# EAGLE design PiKVM_ATX_Adapter v1 (EAGLE 9.6.2)
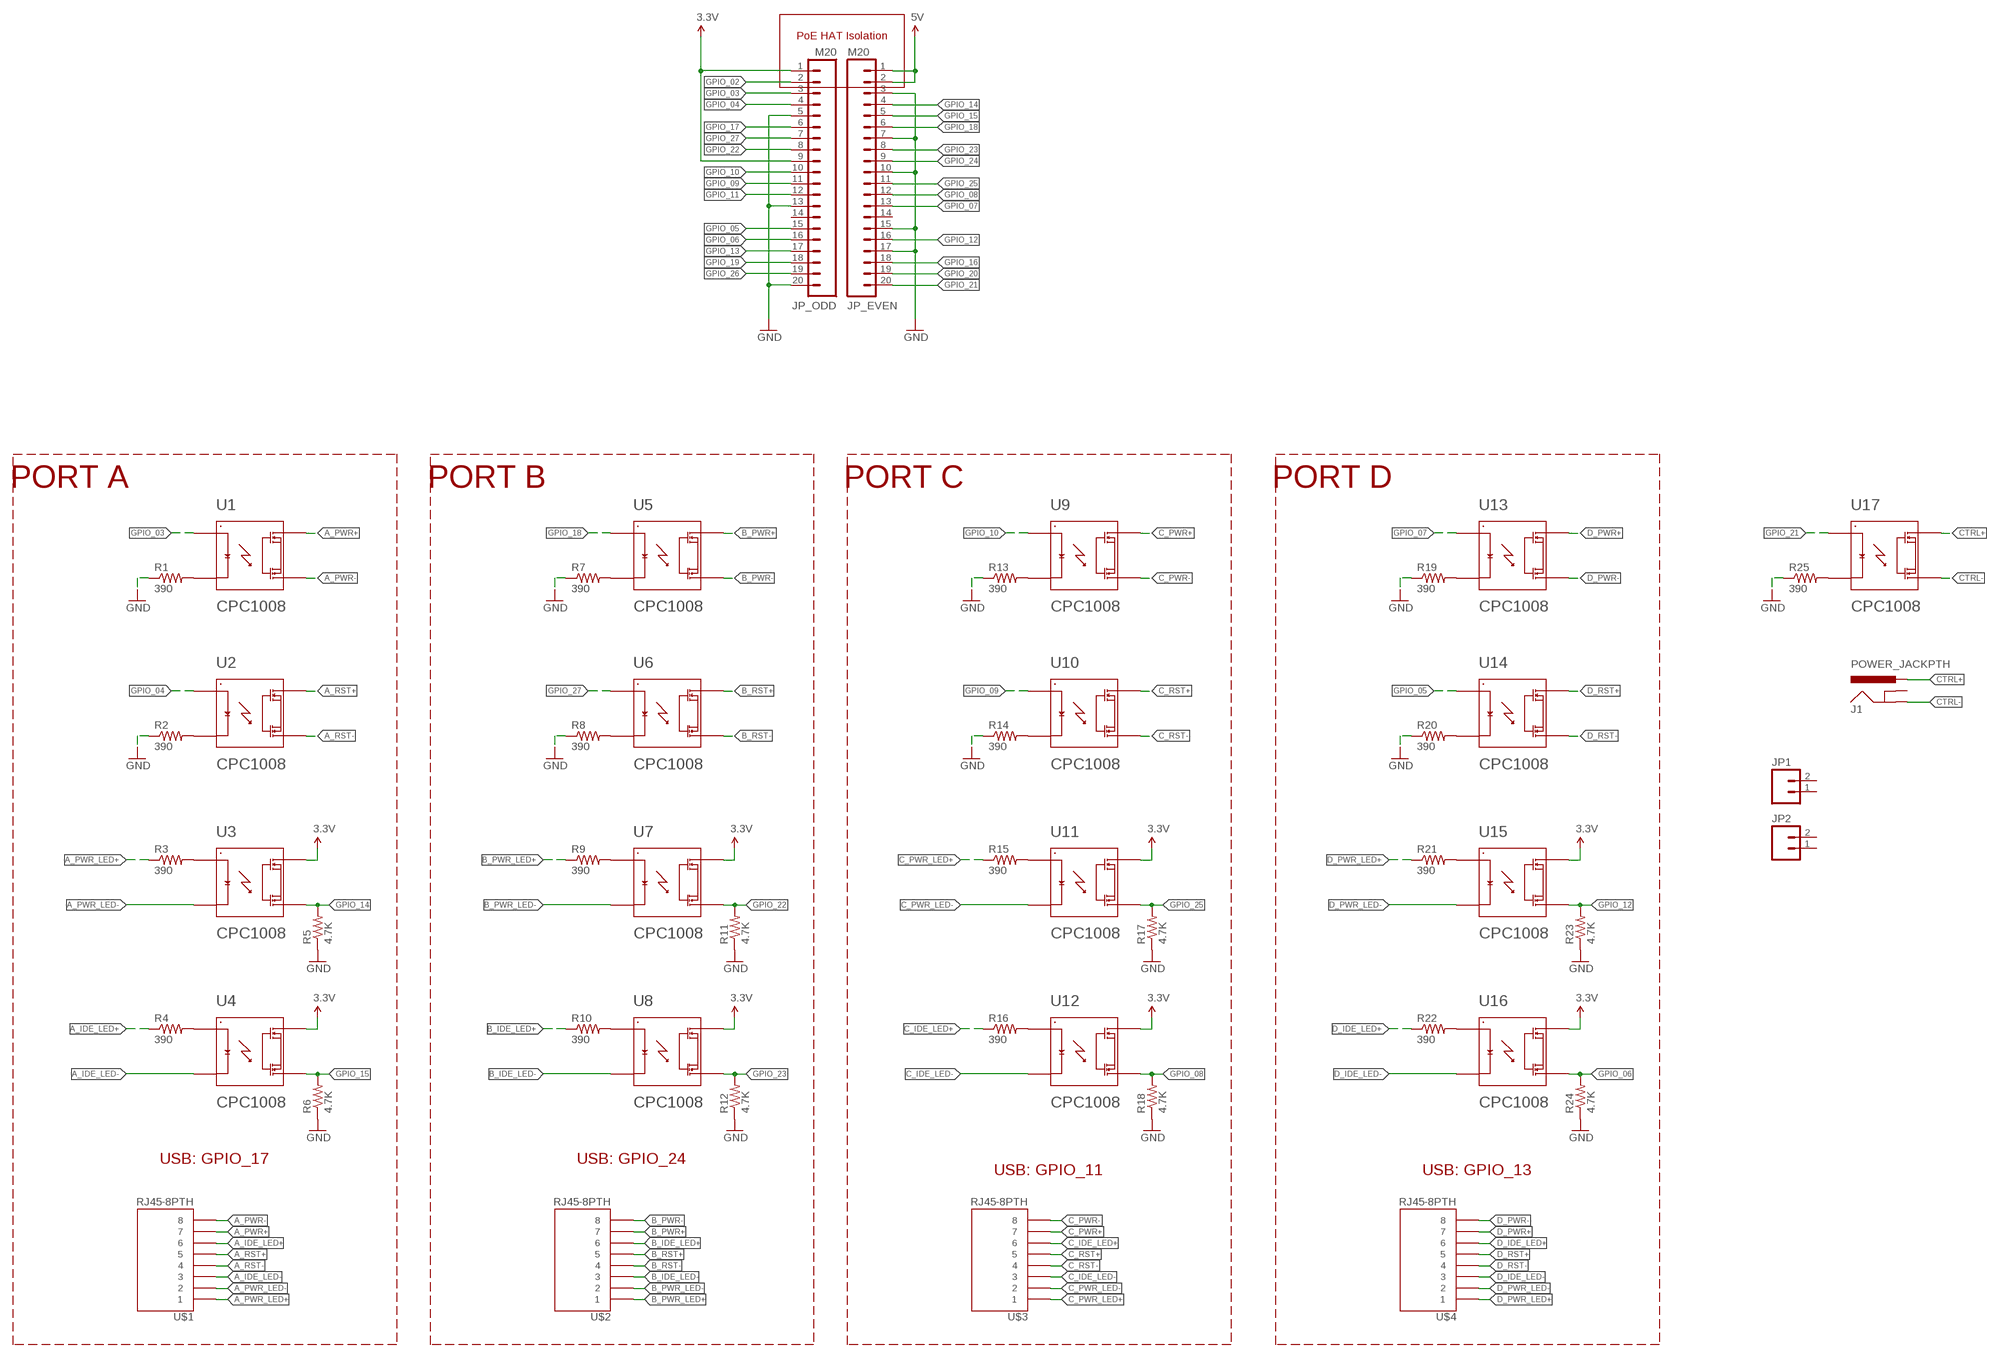
[diagram p0: schematic, sheet 1]

## Parts
J1  POWER_JACKPTH  [POWER_JACK_PTH]
JP1  M02LOCK  [1X02_LOCK]
JP2  M02LOCK  [1X02_LOCK]
JP_EVEN  M20  [1X20]
JP_ODD  M20  [1X20]
R1  390  RESISTOR1206  [1206]
R2  390  RESISTOR1206  [1206]
R3  390  RESISTOR1206  [1206]
R4  390  RESISTOR1206  [1206]
R5  4.7K  RESISTOR1206  [1206]
R6  4.7K  RESISTOR1206  [1206]
R7  390  RESISTOR1206  [1206]
R8  390  RESISTOR1206  [1206]
R9  390  RESISTOR1206  [1206]
R10  390  RESISTOR1206  [1206]
R11  4.7K  RESISTOR1206  [1206]
R12  4.7K  RESISTOR1206  [1206]
R13  390  RESISTOR1206  [1206]
R14  390  RESISTOR1206  [1206]
R15  390  RESISTOR1206  [1206]
R16  390  RESISTOR1206  [1206]
R17  4.7K  RESISTOR1206  [1206]
R18  4.7K  RESISTOR1206  [1206]
R19  390  RESISTOR1206  [1206]
R20  390  RESISTOR1206  [1206]
R21  390  RESISTOR1206  [1206]
R22  390  RESISTOR1206  [1206]
R23  4.7K  RESISTOR1206  [1206]
R24  4.7K  RESISTOR1206  [1206]
R25  390  RESISTOR1206  [1206]
U1  CPC1008  [SOP-4]
U2  CPC1008  [SOP-4]
U3  CPC1008  [SOP-4]
U4  CPC1008  [SOP-4]
U5  CPC1008  [SOP-4]
U6  CPC1008  [SOP-4]
U7  CPC1008  [SOP-4]
U8  CPC1008  [SOP-4]
U9  CPC1008  [SOP-4]
U10  CPC1008  [SOP-4]
U11  CPC1008  [SOP-4]
U12  CPC1008  [SOP-4]
U13  CPC1008  [SOP-4]
U14  CPC1008  [SOP-4]
U15  CPC1008  [SOP-4]
U16  CPC1008  [SOP-4]
U17  CPC1008  [SOP-4]
U$1  RJ45-8PTH  [RJ45-8]
U$2  RJ45-8PTH  [RJ45-8]
U$3  RJ45-8PTH  [RJ45-8]
U$4  RJ45-8PTH  [RJ45-8]

## Nets
3.3V: JP_ODD.1 JP_ODD.9 U3.P$4 U4.P$4 U7.P$4 U8.P$4 U11.P$4 U12.P$4 U15.P$4 U16.P$4
5V: JP_EVEN.1 JP_EVEN.2
A_IDE_LED+: R4.1 U$1.6
A_IDE_LED-: U4.P$2 U$1.3
A_PWR+: U1.P$4 U$1.7
A_PWR-: U1.P$3 U$1.8
A_PWR_LED+: R3.1 U$1.1
A_PWR_LED-: U3.P$2 U$1.2
A_RST+: U2.P$4 U$1.5
A_RST-: U2.P$3 U$1.4
B_IDE_LED+: R10.1 U$2.6
B_IDE_LED-: U8.P$2 U$2.3
B_PWR+: U5.P$4 U$2.7
B_PWR-: U5.P$3 U$2.8
B_PWR_LED+: R9.1 U$2.1
B_PWR_LED-: U7.P$2 U$2.2
B_RST+: U6.P$4 U$2.5
B_RST-: U6.P$3 U$2.4
C_IDE_LED+: R16.1 U$3.6
C_IDE_LED-: U12.P$2 U$3.3
C_PWR+: U9.P$4 U$3.7
C_PWR-: U9.P$3 U$3.8
C_PWR_LED+: R15.1 U$3.1
C_PWR_LED-: U11.P$2 U$3.2
C_RST+: U10.P$4 U$3.5
C_RST-: U10.P$3 U$3.4
CTRL+: J1.PWR U17.P$4
CTRL-: J1.GND U17.P$3
D_IDE_LED+: R22.1 U$4.6
D_IDE_LED-: U16.P$2 U$4.3
D_PWR+: U13.P$4 U$4.7
D_PWR-: U13.P$3 U$4.8
D_PWR_LED+: R21.1 U$4.1
D_PWR_LED-: U15.P$2 U$4.2
D_RST+: U14.P$4 U$4.5
D_RST-: U14.P$3 U$4.4
GND: JP_EVEN.3 JP_EVEN.7 JP_EVEN.10 JP_EVEN.15 JP_EVEN.17 JP_ODD.5 JP_ODD.13 JP_ODD.20 R1.1 R2.1 R5.1 R6.1 R7.1 R8.1 R11.1 R12.1 R13.1 R14.1 R17.1 R18.1 R19.1 R20.1 R23.1 R24.1 R25.1
GPIO_02: JP_ODD.2
GPIO_03: JP_ODD.3 U1.P$1
GPIO_04: JP_ODD.4 U2.P$1
GPIO_05: JP_ODD.15 U14.P$1
GPIO_06: JP_ODD.16 R24.2 U16.P$3
GPIO_07: JP_EVEN.13 U13.P$1
GPIO_08: JP_EVEN.12 R18.2 U12.P$3
GPIO_09: JP_ODD.11 U10.P$1
GPIO_10: JP_ODD.10 U9.P$1
GPIO_11: JP_ODD.12
GPIO_12: JP_EVEN.16 R23.2 U15.P$3
GPIO_13: JP_ODD.17
GPIO_14: JP_EVEN.4 R5.2 U3.P$3
GPIO_15: JP_EVEN.5 R6.2 U4.P$3
GPIO_16: JP_EVEN.18
GPIO_17: JP_ODD.6
GPIO_18: JP_EVEN.6 U5.P$1
GPIO_19: JP_ODD.18
GPIO_20: JP_EVEN.19
GPIO_21: JP_EVEN.20 U17.P$1
GPIO_22: JP_ODD.8 R11.2 U7.P$3
GPIO_23: JP_EVEN.8 R12.2 U8.P$3
GPIO_24: JP_EVEN.9
GPIO_25: JP_EVEN.11 R17.2 U11.P$3
GPIO_26: JP_ODD.19
GPIO_27: JP_ODD.7 U6.P$1
N$1: R2.2 U2.P$2
N$2: R3.2 U3.P$1
N$3: R7.2 U5.P$2
N$4: R1.2 U1.P$2
N$5: R4.2 U4.P$1
N$6: R8.2 U6.P$2
N$7: R9.2 U7.P$1
N$8: R10.2 U8.P$1
N$9: R13.2 U9.P$2
N$10: R14.2 U10.P$2
N$11: R15.2 U11.P$1
N$12: R16.2 U12.P$1
N$13: R19.2 U13.P$2
N$14: R20.2 U14.P$2
N$15: R21.2 U15.P$1
N$16: R22.2 U16.P$1
N$17: R25.2 U17.P$2
Unconnected: J1.GNDBREAK JP1.1 JP1.2 JP2.1 JP2.2 JP_EVEN.14 JP_ODD.14

## Notes on the sheet
- PoE HAT Isolation
- PORT A | PORT B | PORT C | PORT D
- USB: GPIO_17 | USB: GPIO_24
- USB: GPIO_11 | USB: GPIO_13

## Library data of the parts
J1 = SparkFun-Connectors:POWER_JACK: Power Jack This is the standard 5.5mm barrel jack for power. The PTH is the most common, proven, reliable, footprint. The Slot footprint only works if the mill layer is transmitted to the PCB fab house so be warned. Spark Fun Electronics SKU : PRT-00119 SMT: CONN-08106 Mating wall wart : TOL-00298 (and others)
JP1 JP2 = SparkFun-Connectors:M02: Header 2 Standard 2-pin 0.1" header. Use with straight break away headers (SKU : PRT-00116), right angle break away headers (PRT-00553), swiss pins (PRT-00743), machine pins (PRT-00117), and female headers (PRT-00115). Molex polarized connector foot print use with SKU : PRT-08233 with associated crimp pins and housings.
JP_EVEN JP_ODD = SparkFun-Connectors:M20: 1x20 .1" header This is just like the LOCK variant in that the holes are staggared by 5 mil, but except for the last two holes. They are not altered from the "standard" footprint layout. This is used for a special purpose on the layout of our Graphic LCD Backpack. Make sure you want to use this device before selecting it for you project!
R1-R25 = SparkFun-Resistors:RESISTOR: Resistor Basic schematic elements and footprints for 0603, 1206, and PTH resistors.
U1-U17 = MyLib2:CPC1008
U$1-U$4 = SparkFun-Connectors:RJ45-8: RJ45 Jack Simple RJ45, 8-pin connection - connector for common Cat5, Cat5e, and Cat6 Ethernet cables. Footprint not yet proven in production. Connector sku is PRT-00643; Breakout PCB sku is BOB-00716.

## Board
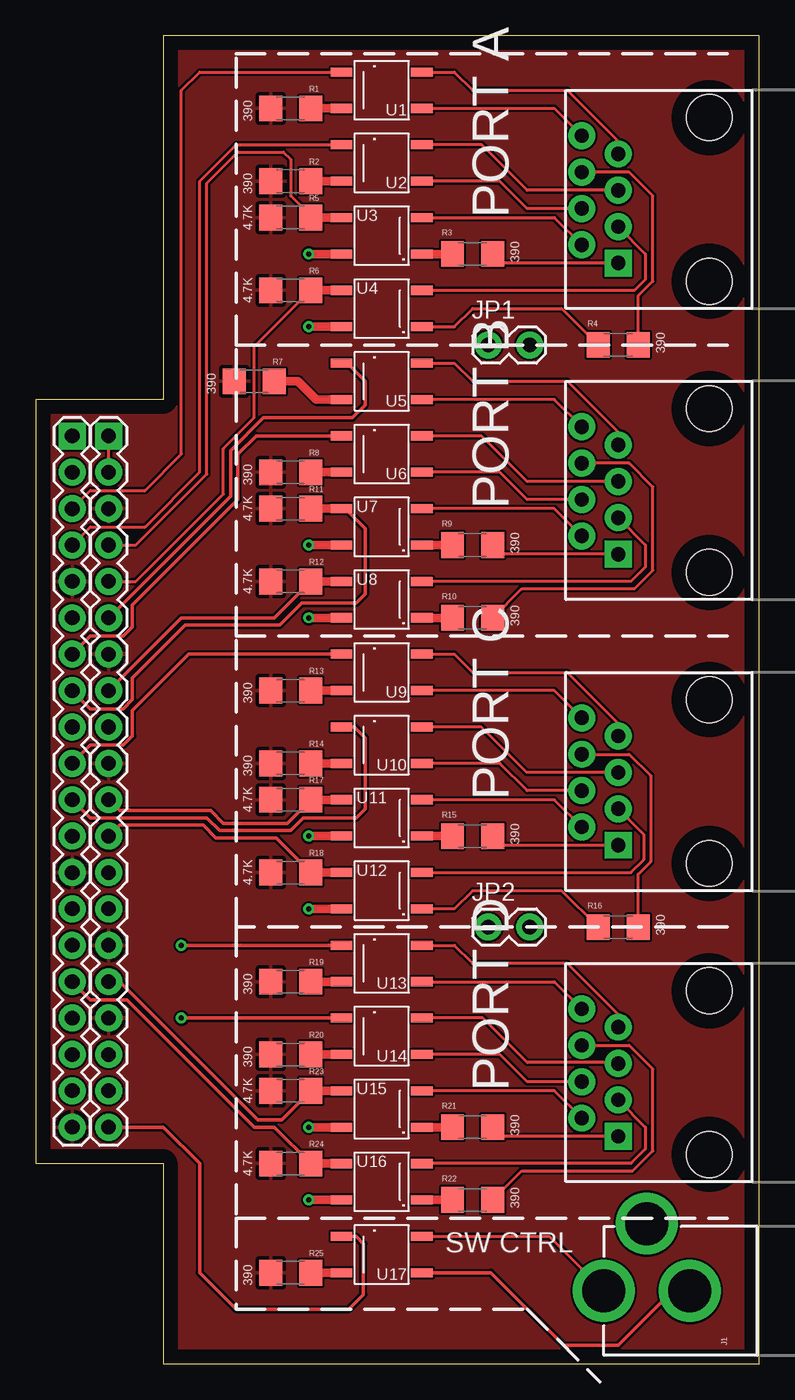
[diagram p1: board, top side]
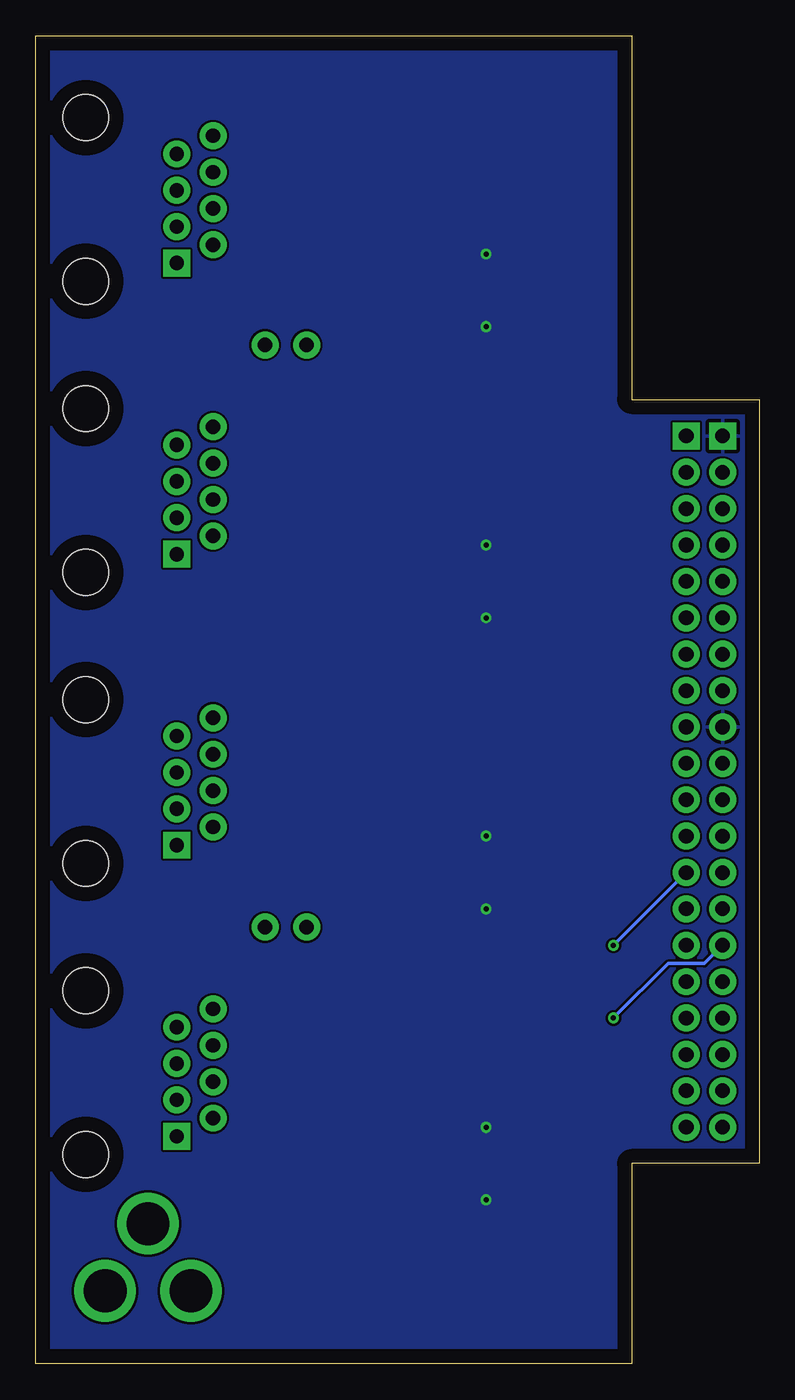
[diagram p2: board, bottom side, seen from below]

Size 50.47 x 92.7 mm. Coordinates in mm from the lower left corner, seen from the top.
Outline: 8.89,0 50.47,0 50.47,92.7 8.89,92.7 8.89,67.31 0,67.31 0,13.97 8.89,13.97 8.89,0
Copper layers (1*16): Top 0.035mm / dielectric 1.5mm / Bottom 0.035mm
Design rules "default": minimum track width 6mil, minimum drill 0.35mm, track to track 6mil, track to pad 6mil, pad to pad 6mil, via to via 6mil, smd to smd 6mil, copper to edge 40mil, drill to drill 6mil, minimum pad ring 10mil, minimum via ring 8mil, stop-mask expansion 4mil, vias tented up to drill 0mil, thermal gap 10mil

### Footprints (pad centres in the part's own frame; a part is rotated, then mirrored left to right if it is on the bottom)
POWER_JACK_PTH = drill 2.997 pad 4.318: GND 0,7.7; GNDBREAK 4.7,10.7; PWR 0,13.7
1X02_LOCK = drill 1.016 pad 1.88: 1 -0.178,0; 2 2.718,0
1X20 = drill 1.016 pad 1.88 square: 1 0,0 | drill 1.016 pad 1.88: 2 2.54,0; 3 5.08,0; 4 7.62,0; 5 10.16,0; 6 12.7,0; 7 15.24,0; 8 17.78,0; 9 20.32,0; 10 22.86,0; 11 25.4,0; 12 27.94,0; 13 30.48,0; 14 33.02,0; 15 35.56,0; 16 38.1,0; 17 40.64,0; 18 43.18,0; 19 45.72,0; 20 48.26,0
1206 = smd 1.6 x 1.8: 1 -1.4,0; 2 1.4,0
SOP-4 = smd 0.635 x 1.524: P$1 -1.27,-2.794; P$2 1.27,-2.794; P$3 1.27,2.794; P$4 -1.27,2.794
RJ45-8 = drill 1 pad 1.88 square: 1 -4.445,6.35 | drill 1 pad 1.88: 2 -3.175,8.89; 3 -1.905,6.35; 4 -0.635,8.89; 5 0.635,6.35; 6 1.905,8.89; 7 3.175,6.35; 8 4.445,8.89 | hole 3.2: -5.715,0; 5.715,0

### Placement (x,y rotation side)
J1  53.34,5.08 90 top
JP1  31.75,71.12 0 top
JP2  31.75,30.48 0 top
JP_EVEN  5.08,64.77 270 top
JP_ODD  2.54,64.77 270 top
R1  17.78,87.63 0 top
R2  17.78,82.55 0 top
R3  30.48,77.47 180 top
R4  40.64,71.12 180 top
R5  17.78,80.01 0 top
R6  17.78,74.93 0 top
R7  15.24,68.58 0 top
R8  17.78,62.23 0 top
R9  30.48,57.15 180 top
R10  30.48,52.07 180 top
R11  17.78,59.69 0 top
R12  17.78,54.61 0 top
R13  17.78,46.99 0 top
R14  17.78,41.91 0 top
R15  30.48,36.83 180 top
R16  40.64,30.48 180 top
R17  17.78,39.37 0 top
R18  17.78,34.29 0 top
R19  17.78,26.67 0 top
R20  17.78,21.59 0 top
R21  30.48,16.51 180 top
R22  30.48,11.43 180 top
R23  17.78,19.05 0 top
R24  17.78,13.97 0 top
R25  17.78,6.35 0 top
U1  24.13,88.9 270 top
U2  24.13,83.82 270 top
U3  24.13,78.74 90 top
U4  24.13,73.66 90 top
U5  24.13,68.58 270 top
U6  24.13,63.5 270 top
U7  24.13,58.42 90 top
U8  24.13,53.34 90 top
U9  24.13,48.26 270 top
U10  24.13,43.18 270 top
U11  24.13,38.1 90 top
U12  24.13,33.02 90 top
U13  24.13,27.94 270 top
U14  24.13,22.86 270 top
U15  24.13,17.78 90 top
U16  24.13,12.7 90 top
U17  24.13,7.62 270 top
U$1  46.99,81.28 90 top
U$2  46.99,60.96 90 top
U$3  46.99,40.64 90 top
U$4  46.99,20.32 90 top

### Tracks (layer width: path | path; a pad name or v marks a point on that pad's centre or on a via)
3.3V  (via drill 0.35)
  Top 0.61: U3.P$4 v19.05,77.47 | U4.P$4 v19.05,72.39 | U7.P$4 v19.05,57.15 | U8.P$4 v19.05,52.07 | U11.P$4 v19.05,36.83 | U12.P$4 v19.05,31.75 | U15.P$4 v19.05,16.51 | U16.P$4 v19.05,11.43
  pour Bottom: -2.54,95.25 -2.54,-1.27 50.8,-1.27 50.8,95.25
5V
  Top 0.203: JP_EVEN.2 JP_EVEN.1
A_IDE_LED+
  Top 0.203: U$1.6 41.4,83.19 43.05,81.53 43.05,75.57 42.04,74.56 R4.1
A_IDE_LED-
  Top 0.203: U$1.3 42.55,77.47 42.55,75.69 41.78,74.93 U4.P$2
A_PWR+
  Top 0.203: U$1.7 40.64,85.34 37.08,88.9 30.48,88.9 29.21,90.17 U1.P$4
A_PWR-
  Top 0.203: U$1.8 36.2,87.63 U1.P$3
A_PWR_LED+
  Top 0.203: U$1.1 32.52,76.84 R3.1
A_PWR_LED-
  Top 0.203: U3.P$2 36.2,80.01 U$1.2
A_RST+
  Top 0.203: U$1.5 34.29,81.92 31.12,85.09 U2.P$4
A_RST-
  Top 0.203: U$1.4 34.29,80.65 32.38,82.55 U2.P$3
B_IDE_LED+
  Top 0.203: R10.1 33.91,54.1 41.78,54.1 43.05,55.37 43.05,61.21 41.4,62.87 U$2.6
B_IDE_LED-
  Top 0.203: U$2.3 42.55,57.15 42.55,55.63 41.53,54.61 U8.P$2
B_PWR+
  Top 0.203: U$2.7 40.64,65.02 37.08,68.58 30.48,68.58 29.21,69.85 U5.P$4
B_PWR-
  Top 0.203: U$2.8 36.2,67.31 U5.P$3
B_PWR_LED+
  Top 0.203: U$2.1 32.52,56.52 R9.1
B_PWR_LED-
  Top 0.203: U$2.2 36.2,59.69 U7.P$2
B_RST+
  Top 0.203: U$2.5 34.29,61.59 31.12,64.77 U6.P$4
B_RST-
  Top 0.203: U6.P$3 32.38,62.23 34.29,60.33 U$2.4
C_IDE_LED+
  Top 0.203: U$3.6 41.4,42.55 42.9,41.05 42.9,35.03 42.04,34.17 R16.1
C_IDE_LED-
  Top 0.203: U$3.3 42.42,36.96 42.42,35.18 41.53,34.29 U12.P$2
C_PWR+
  Top 0.203: U$3.7 40.64,44.7 37.08,48.26 30.48,48.26 29.21,49.53 U9.P$4
C_PWR-
  Top 0.203: U$3.8 36.2,46.99 U9.P$3
C_PWR_LED+
  Top 0.203: U$3.1 32.52,36.19 R15.1
C_PWR_LED-
  Top 0.203: U$3.2 36.2,39.37 U11.P$2
C_RST+
  Top 0.203: U10.P$4 31.08,44.45 34.25,41.28 U$3.5
C_RST-
  Top 0.203: U$3.4 34.29,40 32.38,41.91 U10.P$3
CTRL+
  Top 0.203: U17.P$4 35.83,8.89 J1.PWR
CTRL-
  Top 0.254: U17.P$3 31.75,6.35 36.83,1.27 40.64,1.27 44.45,5.08 J1.GND
D_IDE_LED+
  Top 0.203: U$4.6 41.4,22.22 43.05,20.57 43.05,14.86 41.66,13.46 33.91,13.46 R22.1
D_IDE_LED-
  Top 0.203: U$4.3 42.55,16.51 42.55,14.99 41.53,13.97 U16.P$2
D_PWR+
  Top 0.203: U13.P$4 29.21,29.21 30.48,27.94 37.08,27.94 40.64,24.38 U$4.7
D_PWR-
  Top 0.203: U$4.8 36.2,26.67 U13.P$3
D_PWR_LED+
  Top 0.203: U$4.1 32.52,15.88 R21.1
D_PWR_LED-
  Top 0.203: U$4.2 36.2,19.05 U15.P$2
D_RST+
  Top 0.203: U$4.5 40.56,21.03 34.3,21.03 31.2,24.13 U14.P$4
D_RST-
  Top 0.203: U$4.4 34.29,19.68 32.38,21.59 U14.P$3
GND
  pour Top: -3.81,93.98 -3.81,0 52.07,0 52.07,93.98
GPIO_03
  Top 0.203: JP_ODD.3 3.81,60.96 7.62,60.96 10.16,63.5 10.16,88.9 11.43,90.17 U1.P$1
GPIO_04
  Top 0.203: JP_ODD.4 3.81,58.42 7.62,58.42 11.43,62.23 11.43,82.55 13.97,85.09 U2.P$1
GPIO_05  (via drill 0.35)
  Top 0.254: v10.16,24.13 U14.P$1
  Bottom 0.254: JP_ODD.15 3.81,27.94 6.35,27.94 v10.16,24.13
GPIO_06
  Top 0.254: JP_ODD.16 3.81,25.4 6.35,25.4 15.24,16.51 16.64,16.51 R24.2
  Top 0.61: R24.2 U16.P$3
GPIO_07  (via drill 0.35)
  Top 0.254: v10.16,29.21 U13.P$1
  Bottom 0.254: JP_EVEN.13 v10.16,29.21
GPIO_08
  Top 0.254: R18.2 16.77,36.7 12.57,36.7 11.68,37.59 5.84,37.59 JP_EVEN.12
  Top 0.61: R18.2 U12.P$3
GPIO_09
  Top 0.254: JP_ODD.11 3.81,38.1 11.94,38.1 12.83,37.21 17.78,37.21 18.67,38.1 22.35,38.1 22.99,38.73 22.99,43.69 22.22,44.45 U10.P$1
GPIO_10
  Top 0.254: JP_ODD.10 3.81,43.18 6.1,43.18 6.73,43.81 6.73,45.59 10.67,49.53 U9.P$1
GPIO_12
  Top 0.254: JP_EVEN.16 5.84,26.67 15.49,17.02 17.15,17.02 R23.2
  Top 0.61: R23.2 U15.P$3
GPIO_14
  Top 0.203: R5.2 19.18,80.13 17.78,81.53 17.78,84.07 17.27,84.58 14.1,84.58 11.94,82.42 11.94,62.1 6.98,57.15 JP_EVEN.4
  Top 0.61: U3.P$3 R5.2
GPIO_15
  Top 0.203: JP_EVEN.5 6.98,54.61 13.08,60.71 13.08,63.88 15.24,66.04 15.24,70.99 R6.2
  Top 0.61: U4.P$3 R6.2
GPIO_18
  Top 0.254: JP_EVEN.6 13.59,60.58 13.59,63.75 15.88,66.04 22.1,66.04 22.99,66.93 22.99,68.58 21.72,69.85 U5.P$1
GPIO_21
  Top 0.254: JP_EVEN.20 8.89,16.51 11.43,13.97 11.43,6.35 13.97,3.81 21.84,3.81 22.86,4.83 22.86,8.38 22.35,8.89 U17.P$1
GPIO_22
  Top 0.254: JP_ODD.8 3.81,45.72 6.1,45.72 6.73,46.36 6.73,47.88 10.41,51.56 17.02,51.56 18.54,53.09 22.35,53.09 22.99,53.72 22.99,58.29 21.59,59.69 U7.P$3
  Top 0.61: R11.2 U7.P$3
GPIO_23
  Top 0.254: JP_EVEN.8 10.16,52.07 16.64,52.07 R12.2
  Top 0.61: U8.P$3 R12.2
GPIO_25
  Top 0.254: R17.2 17.53,37.72 13.08,37.72 12.19,38.61 5.84,38.61 JP_EVEN.11
  Top 0.61: R17.2 U11.P$3
GPIO_27
  Top 0.254: JP_ODD.7 3.81,50.8 6.1,50.8 6.73,51.44 6.73,52.96 14.1,60.33 14.1,63.5 15.37,64.77 U6.P$1
N$1
  Top 0.61: U2.P$2 R2.2
N$2
  Top 0.61: U3.P$1 R3.2
N$3
  Top 0.61: R7.2 18.29,68.58 19.56,67.31 U5.P$2
N$4
  Top 0.61: U1.P$2 R1.2
N$5
  Top 0.203: U4.P$1 29.21,72.39 30.48,73.66 36.7,73.66 R4.2
N$6
  Top 0.61: R8.2 U6.P$2
N$7
  Top 0.61: U7.P$1 R9.2
N$8
  Top 0.61: U8.P$1 R10.2
N$9
  Top 0.61: R13.2 U9.P$2
N$10
  Top 0.61: R14.2 U10.P$2
N$11
  Top 0.61: R15.2 U11.P$1
N$12
  Top 0.203: R16.2 36.7,33.02 30.48,33.02 29.21,31.75 U12.P$1
N$13
  Top 0.61: R19.2 U13.P$2
N$14
  Top 0.61: R20.2 U14.P$2
N$15
  Top 0.61: R21.2 U15.P$1
N$16
  Top 0.61: U16.P$1 R22.2
N$17
  Top 0.61: U17.P$2 R25.2

### Text on the board
tNames: PORT A | PORT B | PORT C | PORT D | SW CTRL